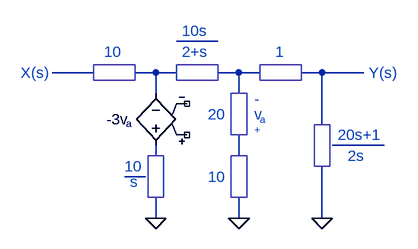
[diagram p0: schematic g2s_simplified.asc]
g2s_simplified.asc, the LTspice schematic file:
Version 4
SHEET 1 1080 680
WIRE 368 176 304 176
WIRE 176 224 112 224
WIRE 272 224 240 224
WIRE 304 224 272 224
WIRE 400 224 368 224
WIRE 432 224 400 224
WIRE 528 224 496 224
WIRE 592 224 528 224
WIRE 272 256 272 224
WIRE 400 256 400 224
WIRE 528 304 528 224
WIRE 624 336 544 336
WIRE 272 352 272 336
WIRE 400 352 400 320
WIRE 256 384 224 384
WIRE 272 448 272 416
WIRE 400 448 400 416
WIRE 528 448 528 368
FLAG 528 448 0
FLAG 400 448 0
FLAG 272 448 0
SYMBOL e 272 352 R180
WINDOW 0 42 56 Left 2
WINDOW 3 37 50 Left 1
SYMATTR InstName -3v
SYMATTR Value a
TEXT 192 192 Left 2 ;10
TEXT 600 224 Left 2 ;Y(s)
TEXT 456 192 Left 2 ;1
TEXT 224 368 Left 2 ;10
TEXT 352 384 Left 2 ;10
TEXT 64 224 Left 2 ;X(s)
TEXT 312 192 Left 2 ;2+s
TEXT 552 320 Left 2 ;20s+1
TEXT 568 352 Left 2 ;2s
TEXT 232 392 Left 2 ;s
TEXT 312 160 Left 2 ;10s
TEXT 352 288 Left 2 ;20
TEXT 424 264 Left 2 ;-
TEXT 424 312 Left 1 ;+
TEXT 424 288 Left 2 ;v
TEXT 432 296 Left 1 ;a
RECTANGLE Normal 496 212 432 236
RECTANGLE Normal 240 212 176 236
RECTANGLE Normal 368 212 304 236
RECTANGLE Normal 388 256 412 320
RECTANGLE Normal 388 352 412 416
RECTANGLE Normal 260 352 284 416
RECTANGLE Normal 516 304 540 368

The netlist it stands for:
* g2s_simplified.asc
E§-3v N007 N003 NC_01 NC_02 a
* 10
* Y(s)
* 1
* 10
* 10
* X(s)
* 2+s
* 20s+1
* 2s
* s
* 10s
* 20
* -
* +
* v
* a
.backanno
.end